# Altium project PCB_Project.PrjPcb
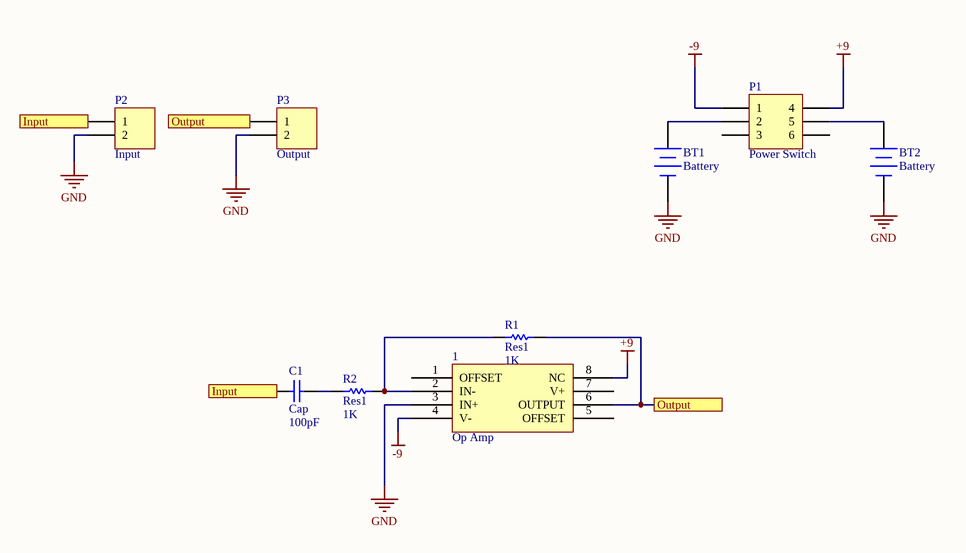
[diagram p0: PCB_Project.SchDoc]
1 sheet, 9 parts. Net scope: flat (ports and power ports of the same name join across sheets).
Board file: PCB_Project.PcbDoc

## Sheet PCB_Project.SchDoc
size A; SheetNumber: 1; SheetTotal: 1

### Parts
1  Op Amp  [Op Amp]
BT1  Battery  [BAT-2]
BT2  Battery  [BAT-2]
C1  Cap  value 100pF  [RAD-0.3]
P1  Power Switch  [HDR2X3_CEN]
P2  Input  [MHDR1X2]
P3  Output  [MHDR1X2]
R1  Res1  value 1K  [AXIAL-0.3]
R2  Res1  value 1K  [AXIAL-0.3]

### Ports
Input, Output

### Nets
+9: 1.8(NC) P1.4
-9: 1.4(V-) P1.1
GND: 1.3(IN+) BT1.2(-) BT2.2(-) P2.2 P3.2
Net1_2: 1.2(IN-) R1.1 R2.2
Net1_6: 1.6(OUTPUT) P3.1 R1.2 ; port Output
NetBT1_1: BT1.1(+) P1.2
NetBT2_1: BT2.1(+) P1.5
NetC1_1: C1.1 P2.1 ; port Input
NetC1_2: C1.2 R2.1

Not connected (* = marked no-connect by the designer): 1 1(OFFSET) 5(OFFSET) 7(V+); P1 3 6

### Library data of the parts
1 = Component_1
BT1 BT2 = Battery: Multicell Battery; Published: 24-Mar-1999; LatestRevisionDate: 17-Jul-2002; LatestRevisionNote: Re-released for DXP Platform.; PackageReference: BAT-2; Publisher: Altium Limited; PackageDescription: Battery; 2 Leads
C1 = Cap: Capacitor; Published: 8-Jun-2000; LatestRevisionDate: 17-Jul-2002; LatestRevisionNote: Re-released for DXP Platform.; PackageReference: RAD-0.3; Publisher: Altium Limited; PackageDescription: Radial Cap, Thru-Hole; 2 Leads; 0.3 in Pin Spacing
P1 = Header 3X2A: Header, 3-Pin, Dual row; LatestRevisionDate: 17-Jul-2002; LatestRevisionNote: Re-released for DXP Platform.; Publisher: Altium Limited
P2 P3 = MHDR1X2: Header, 2-Pin; LatestRevisionDate: 17-Jul-2002; LatestRevisionNote: Re-released for DXP Platform.; Publisher: Altium Limited
R1 R2 = Res1: Resistor; Published: 8-Jun-2000; LatestRevisionDate: 17-Jul-2002; LatestRevisionNote: Re-released for DXP Platform.; PackageReference: AXIAL-0.3; Publisher: Altium Limited; PackageDescription: Axial Device, Thru-Hole; 2 Leads; 0.3 in Pin Spacing